# Altium schematic sheet Connectors.SchDoc
size 594 x 420 mm; SheetNumber: 2; SheetTotal: 4
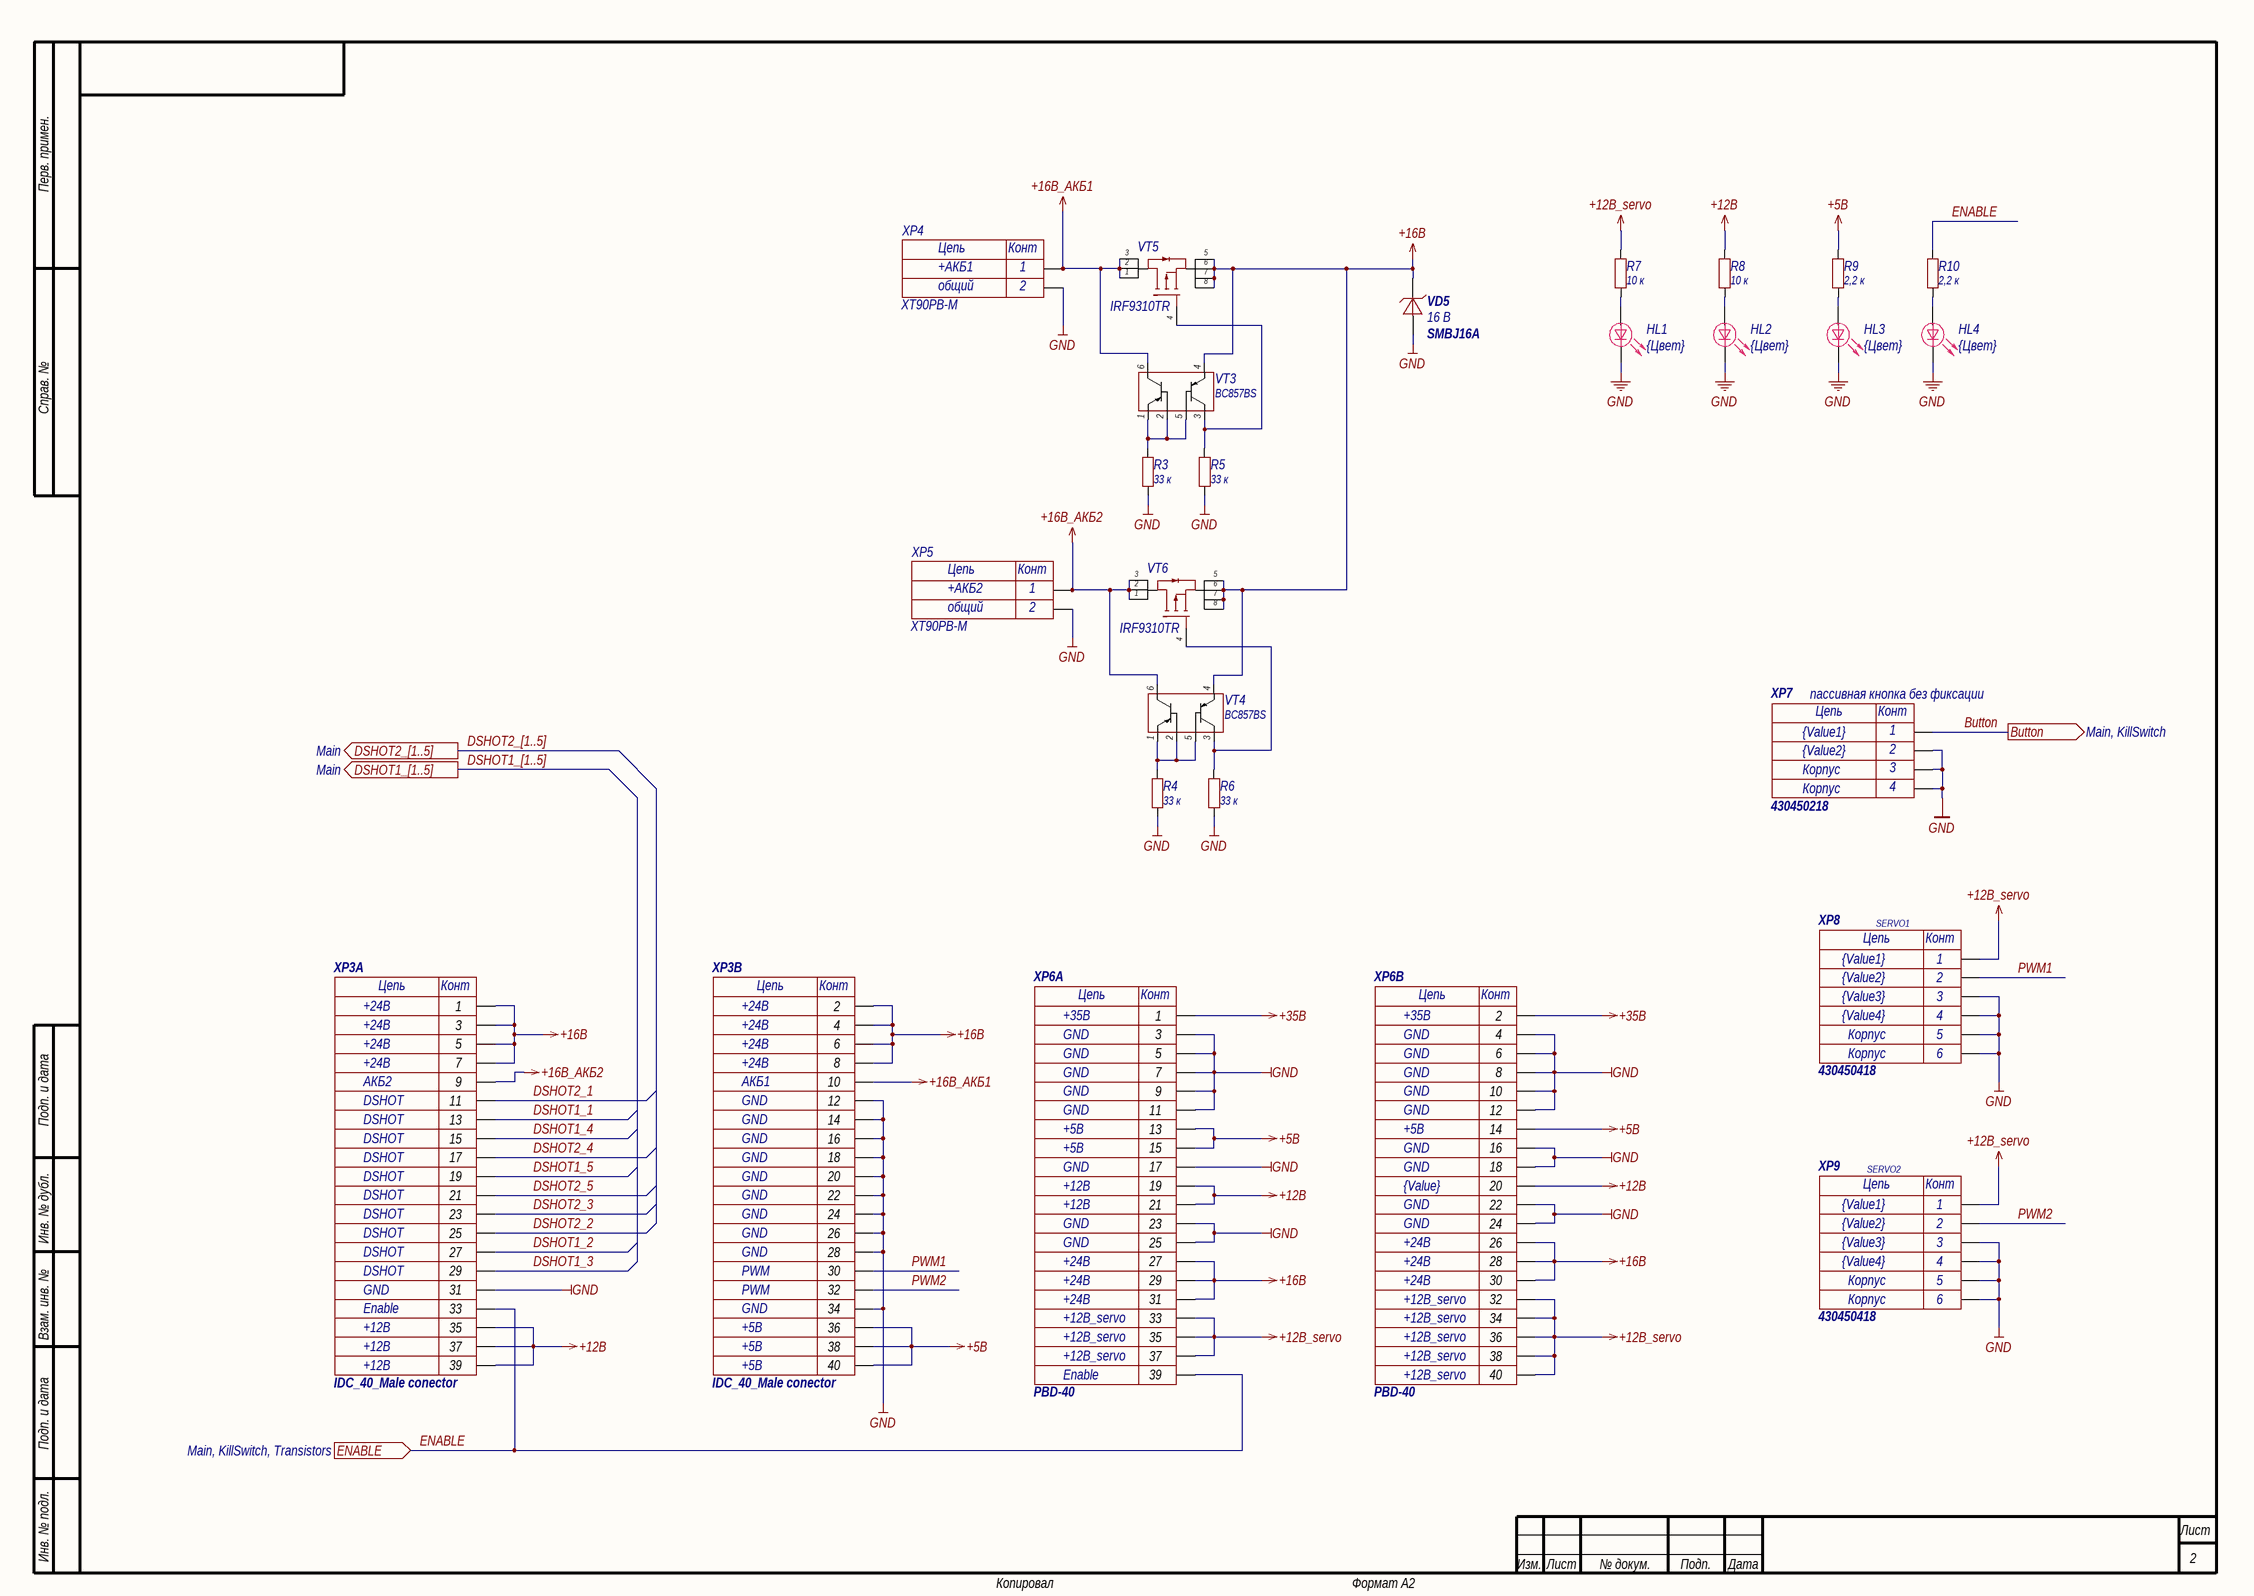
[diagram p0: Connectors.SchDoc]

## Parts
HL1  Color: {Цвет}  [0805D]  (hidden comment: LED)
HL2  Color: {Цвет}  [0805D]  (hidden comment: LED)
HL3  Color: {Цвет}  [0805D]  (hidden comment: LED)
HL4  Color: {Цвет}  [0805D]  (hidden comment: LED)
R3  value 33 к  [0603R]  (hidden comment: Resistor)
R4  value 33 к  [0603R]  (hidden comment: Resistor)
R5  value 33 к  [0603R]  (hidden comment: Resistor)
R6  value 33 к  [0603R]  (hidden comment: Resistor)
R7  value 10 к  [0603R]  (hidden comment: Resistor)
R8  value 10 к  [0603R]  (hidden comment: Resistor)
R9  value 2,2 к  [0603R]  (hidden comment: Resistor)
R10  value 2,2 к  [0603R]  (hidden comment: Resistor)
VD5  SMBJ16A  value 16 В  [SMB]
VT3  BC857BS  [SOT-363_35um]
VT4  BC857BS  [SOT-363_35um]
VT5  IRF9310TR  [SOIC-8]
VT6  IRF9310TR  [SOIC-8]
XP3  IDC_40_Male conector  Value17: Enable  Value20: +12В  Value16: GND  Value15: DSHOT  Value5: АКБ2  Value1: +24В  [IDC_40_Male conector]  (parts A,B of 2)
XP4  XT90PB-M  Value2: общий  Value1: +АКБ1  [XT90PB-M]
XP5  XT90PB-M  Value2: общий  Value1: +АКБ2  [XT90PB-M]
XP6  PBD-40  Value17: +12В_servo  Value20: Enable  Value16: +24В  Value13: GND  Value11: +12В  Value8: +5В  Value1: +35В  [DCDC_SAUVC26]  (parts A,B of 2)
XP7  430450218  Value3: Корпус  Value2: {Value2}  Value1: {Value1}  [Molex_430450218]
XP8  430450418  Value1: {Value1}  Value2: {Value2}  Value3: {Value3}  Value4: {Value4}  [MOLEX_430450418]
XP9  430450418  Value1: {Value1}  Value2: {Value2}  Value3: {Value3}  Value4: {Value4}  [MOLEX_430450418]

## Ports
Button (out, see Main, KillSwitch), DSHOT1_[1..5] (out, see Main), DSHOT2_[1..5] (out, see Main), ENABLE (in, see Main, KillSwitch, Transistors)

## Nets
+5В: R9.2 XP3.36 XP3.38 XP3.40 XP6.13 XP6.14 XP6.15
+12В: R8.2 XP3.35 XP3.37 XP3.39 XP6.19 XP6.20 XP6.21
+12В_servo: R7.2 XP6.32 XP6.33 XP6.34 XP6.35 XP6.36 XP6.37 XP6.38 XP6.40 XP8.1 XP9.1
+16В: VD5.2 VT3.4 VT4.4 VT5.5 VT5.6 VT5.7 VT5.8 VT6.5 VT6.6 VT6.7 VT6.8 XP3.1 XP3.2 XP3.3 XP3.4 XP3.5 XP3.6 XP3.7 XP3.8 XP6.26 XP6.27 XP6.28 XP6.29 XP6.30 XP6.31
+16В_АКБ1: VT3.6 VT5.1 VT5.2 VT5.3 XP3.10 XP4.P
+16В_АКБ2: VT4.6 VT6.1 VT6.2 VT6.3 XP3.9 XP5.P
+35В: XP6.1 XP6.2
GND: HL1.2 HL2.2 HL3.2 HL4.2 R3.1 R4.1 R5.1 R6.1 VD5.1 XP3.12 XP3.14 XP3.16 XP3.18 XP3.20 XP3.22 XP3.24 XP3.26 XP3.28 XP3.31 XP3.34 XP4.N XP5.N XP6.3 XP6.4 XP6.5 XP6.6 XP6.7 XP6.8 XP6.9 XP6.10 XP6.11 XP6.12 XP6.16 XP6.17 XP6.18 XP6.22 XP6.23 XP6.24 XP6.25 XP7.0 XP7.2 XP8.0 XP8.3 XP8.4 XP9.0 XP9.3 XP9.4
Button: XP7.1 ; port Button
DSHOT1_1: XP3.13
DSHOT1_2: XP3.27
DSHOT1_3: XP3.29
DSHOT1_4: XP3.15
DSHOT1_5: XP3.19
DSHOT2_1: XP3.11
DSHOT2_2: XP3.25
DSHOT2_3: XP3.23
DSHOT2_4: XP3.17
DSHOT2_5: XP3.21
ENABLE: R10.2 XP3.33 XP6.39 ; port ENABLE
PWM1: XP3.30 XP8.2
PWM2: XP3.32 XP9.2
NetHL1_1: HL1.1 R7.1
NetHL2_1: HL2.1 R8.1
NetHL3_1: HL3.1 R9.1
NetHL4_1: HL4.1 R10.1
NetR3_2: R3.2 VT3.1 VT3.2 VT3.5
NetR4_2: R4.2 VT4.1 VT4.2 VT4.5
NetR5_2: R5.2 VT3.3 VT5.4
NetR6_2: R6.2 VT4.3 VT6.4

## Buses and harness runs
bus DSHOT1_[1..5] = port DSHOT1_[1..5]
bus DSHOT2_[1..5] = port DSHOT2_[1..5]

## Notes on the sheet
- (near XP7) пассивная кнопка без фиксации
- SERVO1
- SERVO2
- Перв. примен.
- Справ. №
- Подп. и дата
- Инв. № дубл.
- Взам. инв. №
- Инв. № подл.
- Изм.
- Лист
- № докум.
- Подп.
- Дата
- Копировал
- Формат А2
- (in symbol DCDC_SAUVC26, part A) Цепь; Конт
- (in symbol DCDC_SAUVC26, part B) Цепь; Конт
- (in symbol IDC_40_Male conector, part A) Цепь; Конт
- (in symbol IDC_40_Male conector, part B) Цепь; Конт
- (in symbol Molex_430450218) Цепь; Конт; 3; 4
- (in symbol Molex_430450418) Цепь; Конт; Корпус; 5; 6
- (in symbol XT90PB-M) Цепь; Конт; 1; 2

## Library data of the parts
HL1-HL4 = LED: Светодиод; Part Number: LED
R3-R6 = Resistor_33k_1_0603: Резистор номиналом 33 кОм и точностью 1%; Power: *; Part Number: Resistor_33k_1_0603; Tolerance: 1%
R7 R8 = Resistor_10k_1_0603: Резистор номиналом 10 кОм и точностью 1%; Power: *; Part Number: Resistor_10k_1_0603; Tolerance: 1%
R9 R10 = Resistor_2.2k_1_0603: Резистор номиналом 2,2 кОм и точностью 1%; Power: *; Part Number: Resistor_2.2k_1_0603; Tolerance: 1%
VD5 = SMBJ16A: Защитный диод на 16 В, рассеиваемая мощность 600 Вт; Voltage nominal (V): 16; Power (W): 600; Автор: glebmih; Part Number: SMBJ16A
VT3 VT4 = BC857BS: Сборка из биполярных транзисторов, 2 pnp, 45 В,  0.1А; Voltage (V): 45 В; Автор: glebmih; Part Number: BC857BS; Current (A): 0.1 А
VT5 VT6 = IRF9310TR: P-канальный MOSFET, 30 В, 20 А; Voltage (V): 30 В; Current (A): 20 А; Автор: glebmih; Part Number: IRF9310TR
XP3 = IDC_40_Male conector: IDC 40-пиновый разъём прямая вилка; System: Connector; Value19: +12В; Value18: +12В; Value14: DSHOT; Value13: DSHOT; Value12: DSHOT; Value11: DSHOT; Value10: DSHOT; Value9: DSHOT; Value8: DSHOT; Value7: DSHOT; Value6: DSHOT; Part Number: IDC_40_Male conector
XP4 XP5 = XT90PB-M: 90 А (60 продолжительно), 2 контакта, прямой отец; System: Connector; Part Number: XT90PB-M
XP6 = DCDC_SAUVC26: Плата DCDC преобрахователей; Value19: +12В_servo; Value18: +12В_servo; Value15: +24В; Value14: +24В; Value12: GND; Value10: +12В; Value9: GND; Value7: +5В; Value6: GND; Value5: GND; Value4: GND; Value3: GND; Value2: GND
XP7 = Molex_430450218: Разъем типа провод-плата, 3 мм, 2 контакт(-ов), Штыревой Разъем, Серия Micro-Fit для поверхностного монтажа; System: Connector; Value4: Корпус; Part Number: Molex_430450218
XP8 XP9 = Molex_430450418: Разъем типа провод-плата, 3 мм, 4 контакт(-ов), Штыревой Разъем, для поверностного монтажа; System: Connector; Part Number: Molex_430450418